# Altium project 2020年电赛校赛.PrjPcb
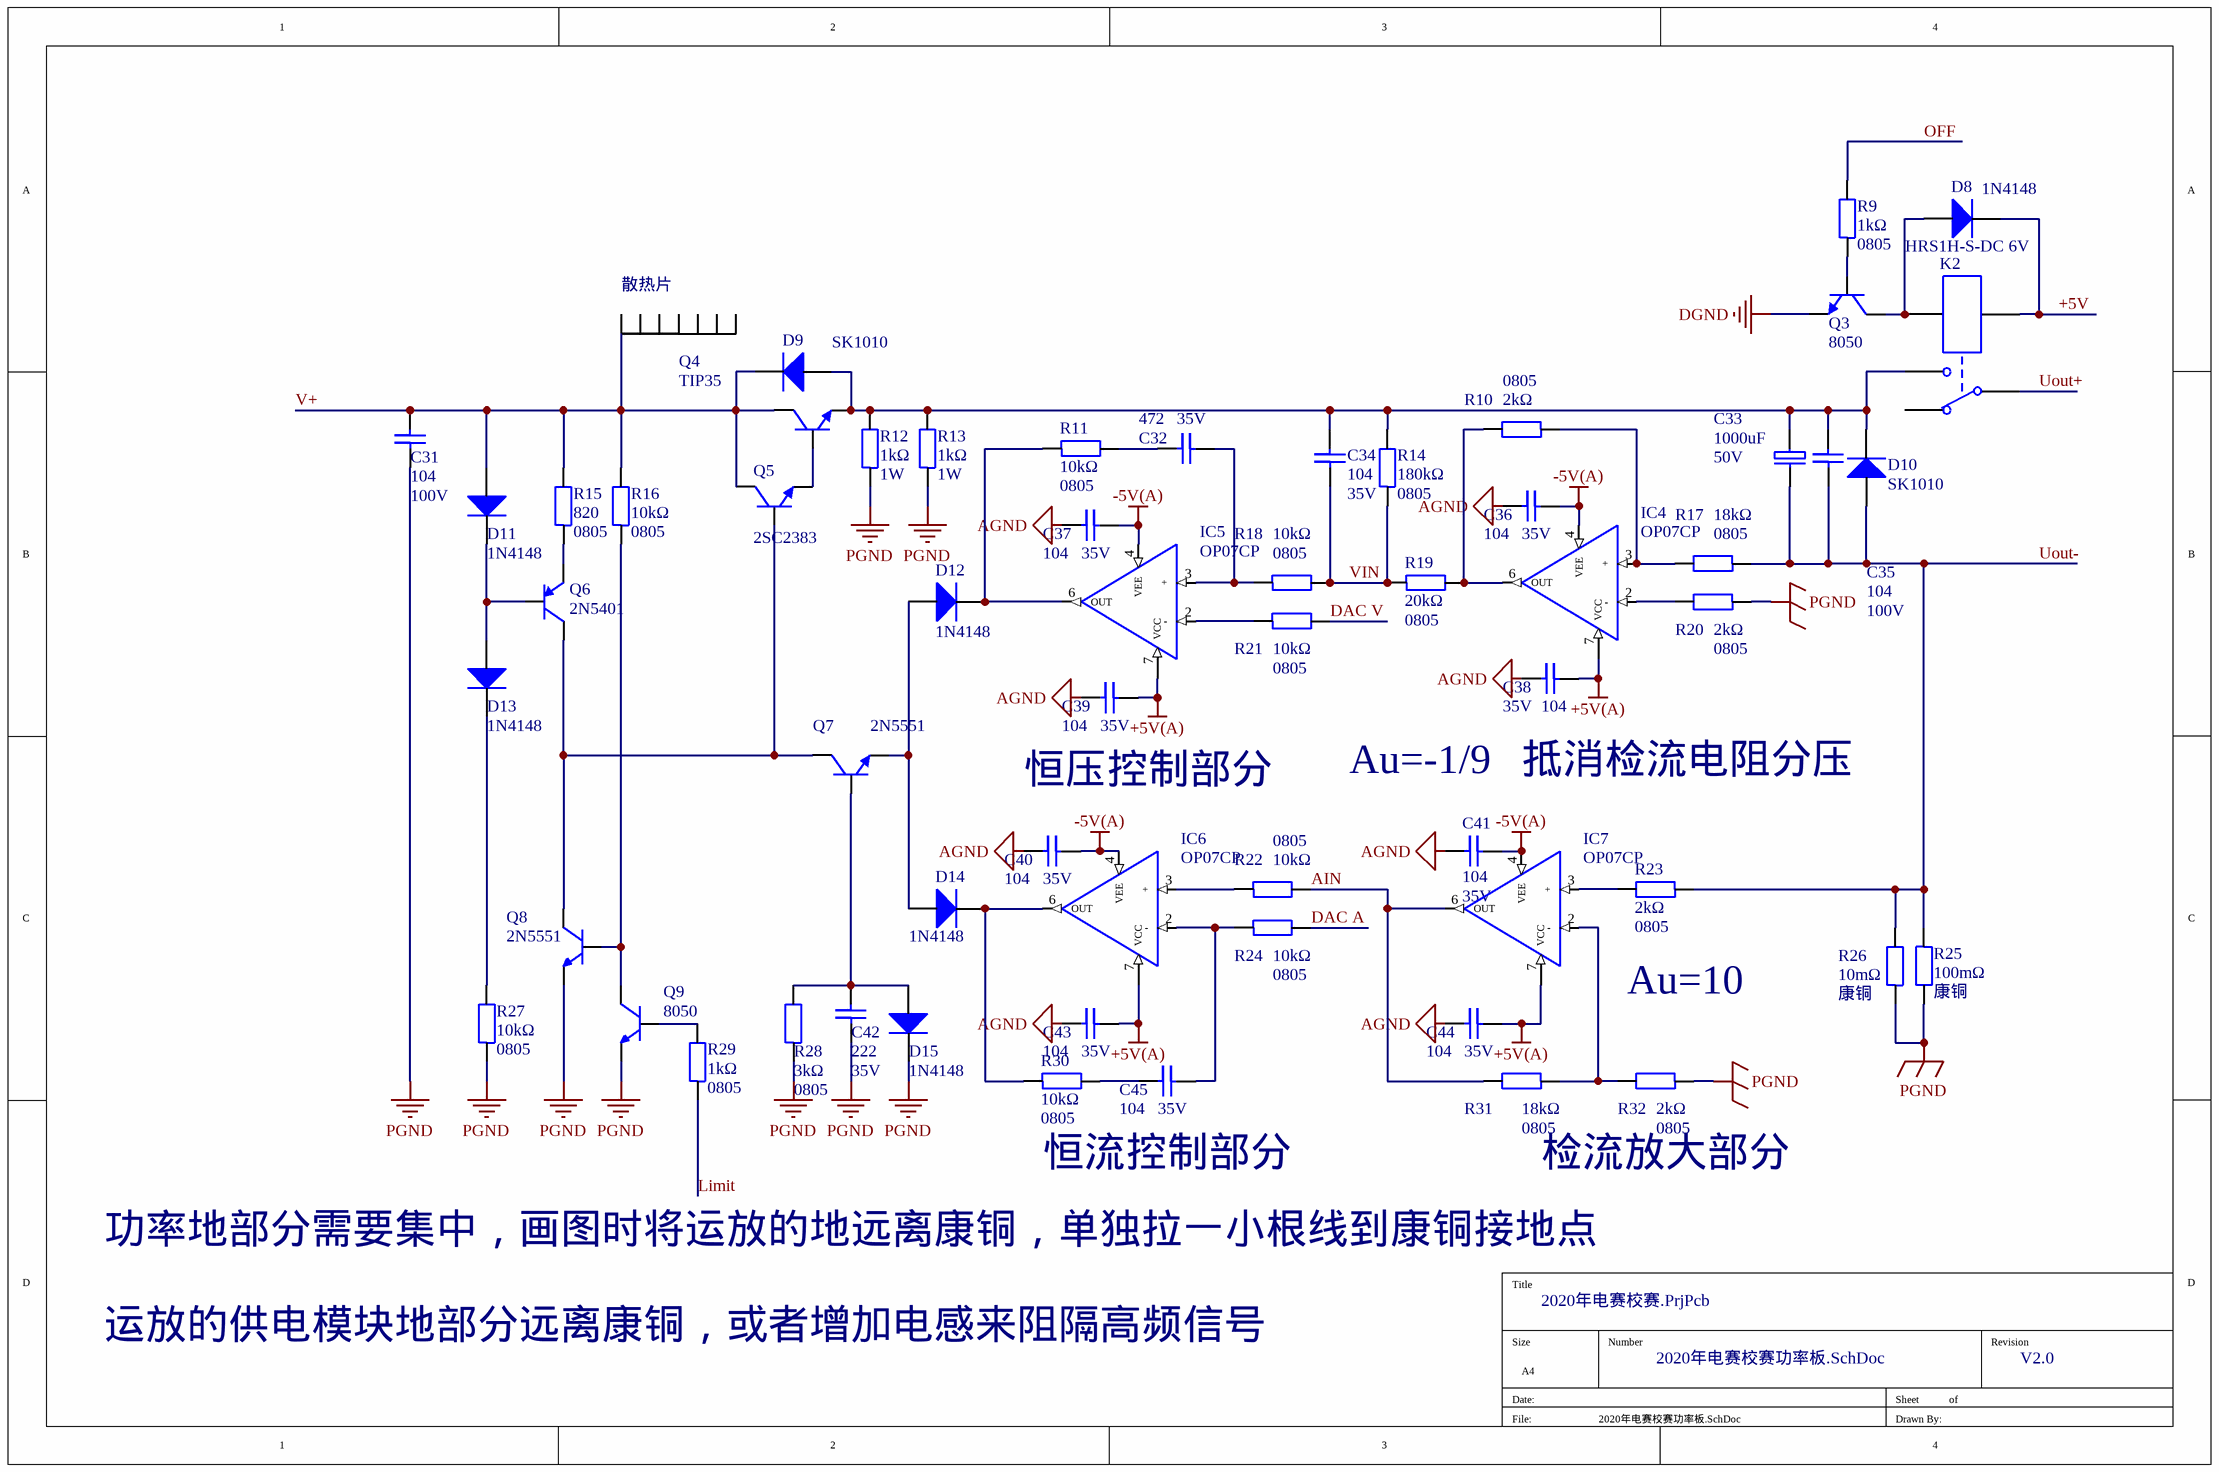
[diagram p0: 2020年电赛校赛功率板.SchDoc]
5 sheets, 183 parts. Net scope: global (net labels, ports and power ports of the same name join across sheets).
Board files: 2020年电赛校赛 V1.0.PcbDoc, 电赛校赛 V2.0.PcbDoc
Sheets:
  2020年电赛校赛功率板.SchDoc
  2020年电赛校赛电源板.SchDoc
  2020年电赛校赛测量、基准板.SchDoc
  2020年电赛校赛接口板.SchDoc
  2020年电赛校赛数字板.SchDoc

## Sheet 2020年电赛校赛功率板.SchDoc
size A4; DocumentNumber: 1; Revision: V2.0; SheetNumber: 1; SheetTotal: 5

### Parts
C31  104  value 100V  [C0805]
C32  472  value 35V  [C0805]
C33  1000uF  value 50V  [50V 1000uF]
C34  104  value 35V  [C0805]
C35  104  value 100V  [C0805]
C36  104  value 35V  [C0805]
C37  104  value 35V  [C0805]
C38  104  value 35V  [C0805]
C39  104  value 35V  [C0805]
C40  104  value 35V  [C0805]
C41  104  value 35V  [C0805]
C42  222  value 35V  [C0805]
C43  104  value 35V  [C0805]
C44  104  value 35V  [C0805]
C45  104  value 35V  [C0805]
D8  1N4148  [LL34]
D9  SK1010  [SMC(DO-214AB)]
D10  SK1010  [SMC(DO-214AB)]
D11  1N4148  [LL34]
D12  1N4148  [LL34]
D13  1N4148  [LL34]
D14  1N4148  [LL34]
D15  1N4148  [LL34]
IC4  OP07CP  [SOP-8(体宽3.8mm)]
IC5  OP07CP  [SOP-8(体宽3.8mm)]
IC6  OP07CP  [SOP-8(体宽3.8mm)]
IC7  OP07CP  [SOP-8(体宽3.8mm)]
K2  HRS1H-S-DC 6V  [HRS1H-S-DC 6V]
Q3  8050  [SOT-23]
Q4  TIP35  [TO-247]
Q5  2SC2383  [TO-92]
Q6  2N5401  [SOT-23]
Q7  2N5551  [SOT-23]
Q8  2N5551  [SOT-23]
Q9  8050  [SOT-23]
R9  1kΩ  value 0805  [R0805]
R10  2kΩ  value 0805  [R0805]
R11  10kΩ  value 0805  [R0805]
R12  1kΩ  value 1W  [Res-1W]
R13  1kΩ  value 1W  [Res-1W]
R14  180kΩ  value 0805  [R0805]
R15  820  value 0805  [R0805]
R16  10kΩ  value 0805  [R0805]
R17  18kΩ  value 0805  [R0805]
R18  10kΩ  value 0805  [R0805]
R19  20kΩ  value 0805  [R0805]
R20  2kΩ  value 0805  [R0805]
R21  10kΩ  value 0805  [R0805]
R22  10kΩ  value 0805  [R0805]
R23  2kΩ  value 0805  [R0805]
R24  10kΩ  value 0805  [R0805]
R25  100mΩ  value 康铜  [100mΩ康铜]
R26  10mΩ  value 康铜  [10mΩ康铜]
R27  10kΩ  value 0805  [R0805]
R28  3kΩ  value 0805  [R0805]
R29  1kΩ  value 0805  [R0805]
R30  10kΩ  value 0805  [R0805]
R31  18kΩ  value 0805  [R0805]
R32  2kΩ  value 0805  [R0805]
S1  散热片  [散热片]  (value not drawn)

### Nets
+5V: D8.2(K) K2.2
+5V(A): C38.2 C39.2 C43.2 C44.2 IC4.7(VCC) IC5.7(VCC) IC6.7(VCC) IC7.7(VCC)
-5V(A): C36.2 C37.2 C40.2 C41.2 IC4.4(VEE) IC5.4(VEE) IC6.4(VEE) IC7.4(VEE)
AGND: C36.1 C37.1 C38.1 C39.1 C40.1 C41.1 C43.1 C44.1
DGND: Q3.2(E)
PGND: C31.1 C42.1 D15.2(K) Q8.2(E) Q9.2(E) R12.1 R13.1 R20.1 R25.2 R26.1 R27.1 R28.1 R32.1
AIN: IC7.6(OUT) R22.2 R31.2
DAC A: R24.2
DAC V: R21.2
Limit: R29.1
OFF: R9.2
Uout+: K2.4
Uout-: C33.2(-) C35.1 D10.1(A) R17.1 R23.1 R25.1 R26.2
V+: C31.2 D9.2(K) D11.1(A) Q4.2(C) Q5.2(C) R15.2 R16.2 S1.1
VIN: C34.1 R14.1 R18.2 R19.1
NetC32_1: C32.1 R11.2
NetC32_2: C32.2 IC5.3(+) R18.1
NetC33_1: C33.1(+) C34.2 C35.2 D9.1(A) D10.2(K) K2.6 Q4.3(E) R12.2 R13.2 R14.2
NetC42_2: C42.2 D15.1(A) Q7.1(B) R28.2
NetC45_1: C45.1 R30.2
NetC45_2: C45.2 IC6.2(-) R24.1
NetD8_1: D8.1(A) K2.5 Q3.3(C)
NetD11_2: D11.2(K) D13.1(A) Q6.1(B)
NetD12_1: D12.1(A) D14.1(A) Q7.2(E)
NetD12_2: D12.2(K) IC5.6(OUT) R11.1
NetD13_2: D13.2(K) R27.2
NetD14_2: D14.2(K) IC6.6(OUT) R30.1
NetIC4_2: IC4.2(-) R20.2
NetIC4_3: IC4.3(+) R10.1 R17.2
NetIC4_6: IC4.6(OUT) R10.2 R19.2
NetIC5_2: IC5.2(-) R21.1
NetIC6_3: IC6.3(+) R22.1
NetIC7_2: IC7.2(-) R31.1 R32.2
NetIC7_3: IC7.3(+) R23.2
NetQ3_1: Q3.1(B) R9.1
NetQ4_1: Q4.1(B) Q5.1(E)
NetQ5_3: Q5.3(B) Q6.3(C) Q7.3(C) Q8.3(C)
NetQ6_2: Q6.2(E) R15.1
NetQ8_1: Q8.1(B) Q9.3(C) R16.1
NetQ9_1: Q9.1(B) R29.2

Not connected (* = marked no-connect by the designer): K2 1; S1 2

### Notes on the sheet
- (near S1) 散热片
- 恒压控制部分
- Au=-1/9
- 抵消检流电阻分压
- Au=10
- 恒流控制部分
- 检流放大部分
- 功率地部分需要集中，画图时将运放的地远离康铜，单独拉一小根线到康铜接地点
- 运放的供电模块地部分远离康铜，或者增加电感来阻隔高频信号

### Library data of the parts
C31 C32 C34-C45 = 104: 无极性电容
C33 = 100uF: 有极性电容
D8-D15 = Diode: 二极管
IC4-IC7 = OP07CP: 运放
K2 = HRS1H-S-DC 6V: 继电器
Q3-Q5 Q7 = NPN: 三极管
Q6 = PNP
Q8 = NPN!
Q9 = NPN!: 三极管
R9-R32 = 10kΩ: 贴片/直插电阻

## Sheet 2020年电赛校赛电源板.SchDoc
size A4; DocumentNumber: 2; Revision: V2.0; SheetNumber: 2; SheetTotal: 5
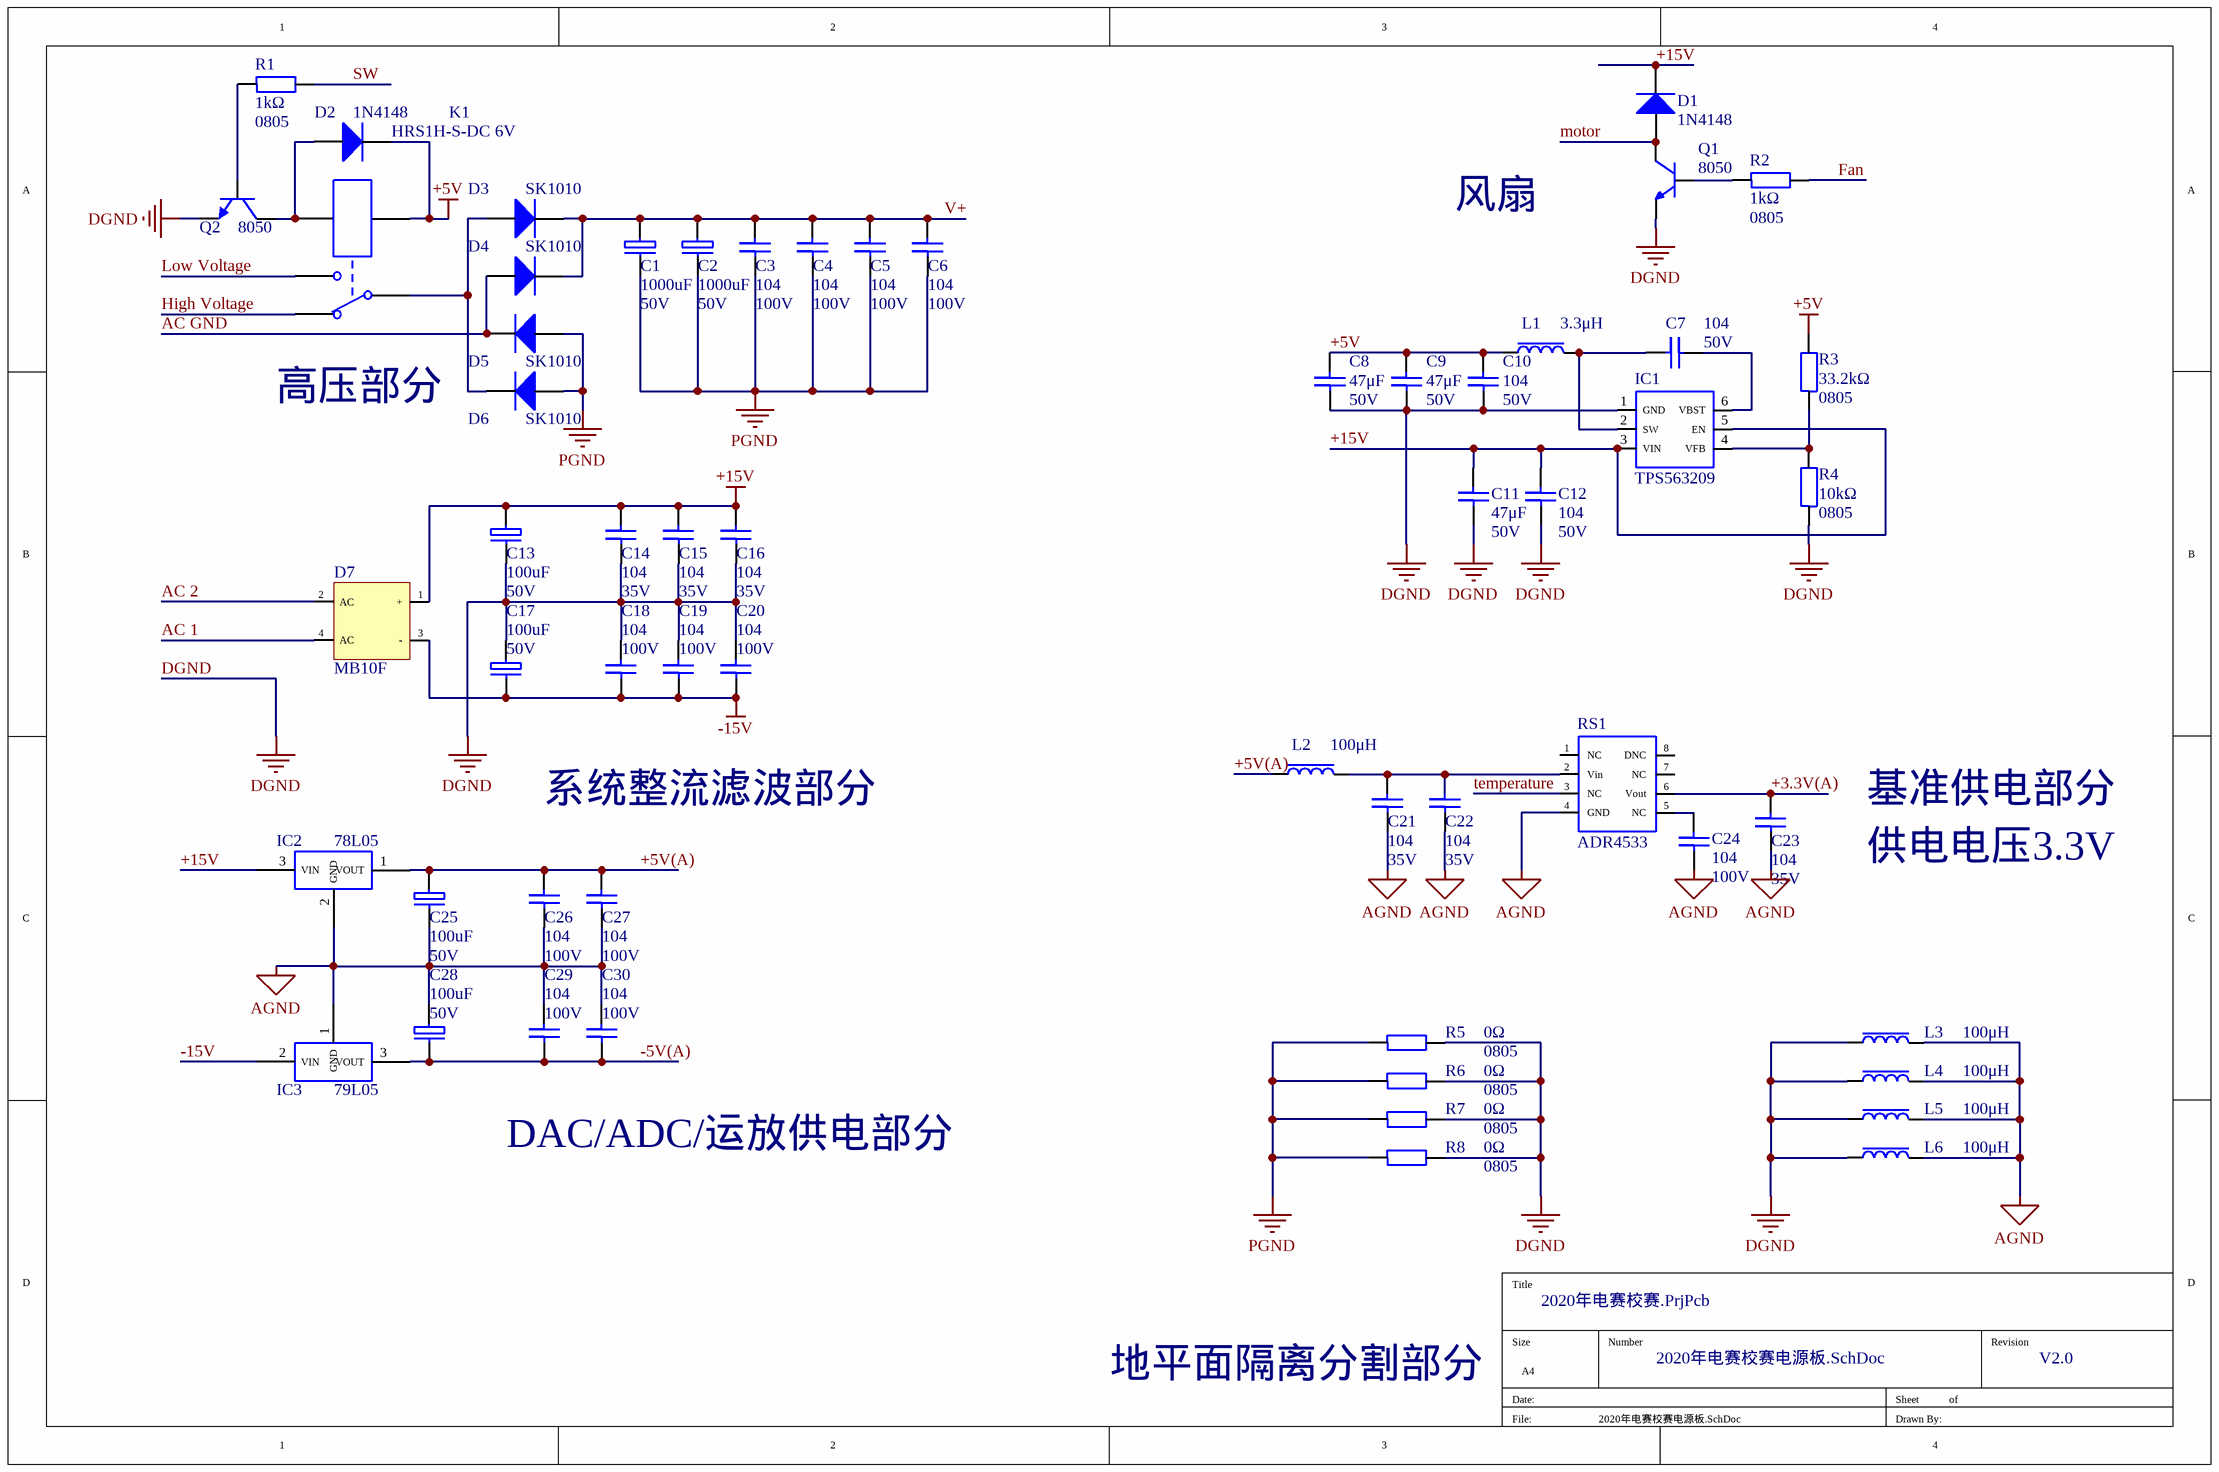
[diagram p1: 2020年电赛校赛电源板.SchDoc]

### Parts
C1  1000uF  value 50V  [50V 1000uF]
C2  1000uF  value 50V  [50V 1000uF]
C3  104  value 100V  [C0805]
C4  104  value 100V  [C0805]
C5  104  value 100V  [C0805]
C6  104  value 100V  [C0805]
C7  104  value 50V  [C0805]
C8  47μF  value 50V  [C1210]
C9  47μF  value 50V  [C1210]
C10  104  value 50V  [C0805]
C11  47μF  value 50V  [C1210]
C12  104  value 50V  [C0805]
C13  100uF  value 50V  [35V 470uF]
C14  104  value 35V  [C0805]
C15  104  value 35V  [C0805]
C16  104  value 35V  [C0805]
C17  100uF  value 50V  [35V 470uF]
C18  104  value 100V  [C0805]
C19  104  value 100V  [C0805]
C20  104  value 100V  [C0805]
C21  104  value 35V  [C0805]
C22  104  value 35V  [C0805]
C23  104  value 35V  [C0805]
C24  104  value 100V  [C0805]
C25  100uF  value 50V  [35V 470uF]
C26  104  value 100V  [C0805]
C27  104  value 100V  [C0805]
C28  100uF  value 50V  [35V 470uF]
C29  104  value 100V  [C0805]
C30  104  value 100V  [C0805]
D1  1N4148  [LL34]
D2  1N4148  [LL34]
D3  SK1010  [SMC(DO-214AB)]
D4  SK1010  [SMC(DO-214AB)]
D5  SK1010  [SMC(DO-214AB)]
D6  SK1010  [SMC(DO-214AB)]
D7  MB10F  [整流桥 SMD]
IC1  TPS563209  [TSOP-6]
IC2  78L05  [SOT-89]
IC3  79L05  [SOT-89]
K1  HRS1H-S-DC 6V  [HRS1H-S-DC 6V]
L1  3.3μH  [L0630]
L2  100μH  [R0805]
L3  100μH  [R0805]
L4  100μH  [R0805]
L5  100μH  [R0805]
L6  100μH  [R0805]
Q1  8050  [SOT-23]
Q2  8050  [SOT-23]
R1  1kΩ  value 0805  [R0805]
R2  1kΩ  value 0805  [R0805]
R3  33.2kΩ  value 0805  [R0805]
R4  10kΩ  value 0805  [R0805]
R5  0Ω  value 0805  [R0805]
R6  0Ω  value 0805  [R0805]
R7  0Ω  value 0805  [R0805]
R8  0Ω  value 0805  [R0805]
RS1  ADR4533  [SOP-8(体宽3.8mm)]

### Nets
+5V: C8.2 C9.2 C10.2 D2.2(K) K1.2 L1.2 R3.2
+5V(A): C25.1(+) C26.2 C27.2 IC2.1(VOUT) L2.2
+15V: C11.2 C12.2 C13.1(+) C14.2 C15.2 C16.2 D1.2(K) D7.1(+) IC1.3(VIN) IC1.5(EN) IC2.3(VIN)
-5V(A): C28.2(-) C29.1 C30.1 IC3.3(VOUT)
-15V: C17.2(-) C18.1 C19.1 C20.1 D7.3(-) IC3.2(VIN)
AGND: C21.1 C22.1 C23.1 C24.1 C25.2(-) C26.1 C27.1 C28.1(+) C29.2 C30.2 IC2.2(GND) IC3.1(GND) L3.1 L4.1 L5.1 L6.1 RS1.4(GND)
DGND: C8.1 C9.1 C10.1 C11.1 C12.1 C13.2(-) C14.1 C15.1 C16.1 C17.1(+) C18.2 C19.2 C20.2 IC1.1(GND) L3.2 L4.2 L5.2 L6.2 Q1.2(E) Q2.2(E) R4.1 R5.2 R6.2 R7.2 R8.2
PGND: C1.2(-) C2.2(-) C3.1 C4.1 C5.1 C6.1 D5.1(A) D6.1(A) R5.1 R6.1 R7.1 R8.1
+3.3V(A): C23.2 RS1.6(Vout)
AC 1: D7.4(AC)
AC 2: D7.2(AC)
AC GND: D4.1(A) D5.2(K)
Fan: R2.2
High Voltage: K1.1
Low Voltage: K1.6
motor: D1.1(A) Q1.3(C)
SW: R1.2
temperature: RS1.3(NC)
V+: C1.1(+) C2.1(+) C3.2 C4.2 C5.2 C6.2 D3.2(K) D4.2(K)
NetC7_1: C7.1 IC1.2(SW) L1.1
NetC7_2: C7.2 IC1.6(VBST)
NetC21_2: C21.2 C22.2 L2.1 RS1.2(Vin)
NetC24_2: C24.2 RS1.5(NC)
NetD2_1: D2.1(A) K1.5 Q2.3(C)
NetD3_1: D3.1(A) D6.2(K) K1.4
NetIC1_4: IC1.4(VFB) R3.1 R4.2
NetQ1_1: Q1.1(B) R2.1
NetQ2_1: Q2.1(B) R1.1

Not connected (* = marked no-connect by the designer): RS1 1(NC) 7(NC) 8(DNC)

### Notes on the sheet
- 风扇
- (near K1) 高压部分
- 系统整流滤波部分
- 基准供电部分
- 供电电压3.3V
- DAC/ADC/运放供电部分
- 地平面隔离分割部分

### Library data of the parts
C1 C2 C13 C17 C25 C28 = 100uF: 有极性电容
C3-C12 C14-C16 C18-C24 C26 C27 C29 C30 = 104: 无极性电容
D1-D6 = Diode: 二极管
D7 = MB10F: 1A 1000V整流桥
IC1 = TPS563209/563309: buck型电源管理
IC2 = AMS1117-3.3: LDO
IC3 = 790?: LDO
K1 = HRS1H-S-DC 6V: 继电器
L1-L6 = 470mH: 电感
Q1 = NPN!: 三极管
Q2 = NPN: 三极管
R1-R8 = 10kΩ: 贴片/直插电阻
RS1 = ADR4533: 高精度基准源

## Sheet 2020年电赛校赛测量、基准板.SchDoc
size A4; DocumentNumber: 3; Revision: V2.0; SheetNumber: 3; SheetTotal: 5
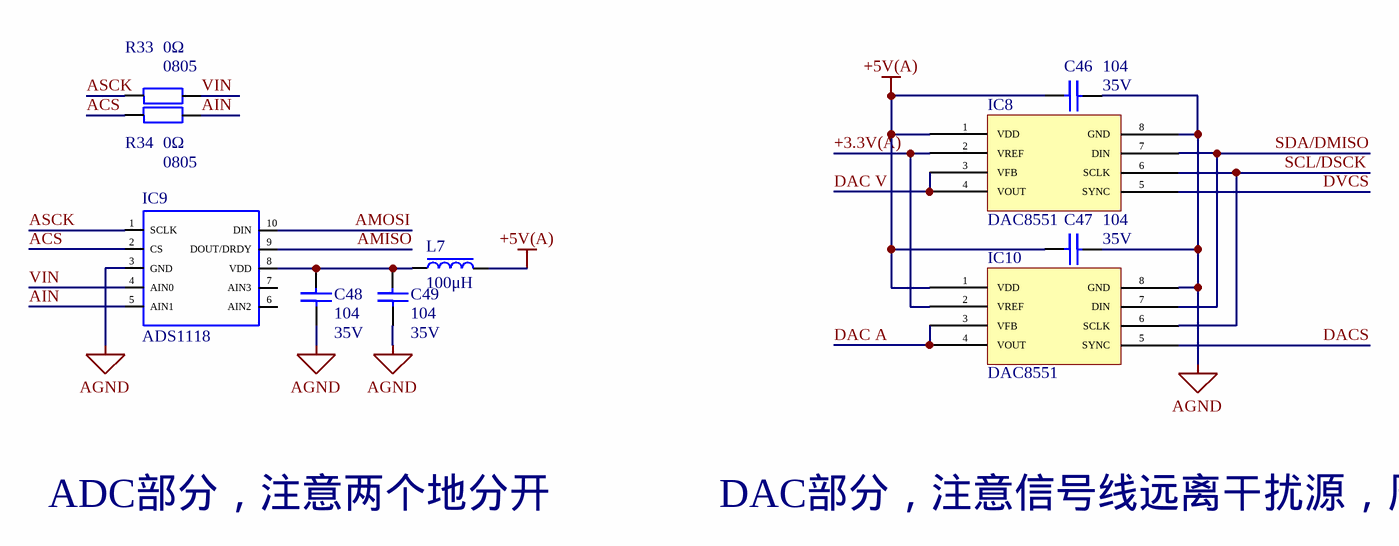
[diagram p2: 2020年电赛校赛测量、基准板.SchDoc]

### Parts
C46  104  value 35V  [C0805]
C47  104  value 35V  [C0805]
C48  104  value 35V  [C0805]
C49  104  value 35V  [C0805]
IC8  DAC8551  [MSOP-8]
IC9  ADS1118  [MSOP-10]
IC10  DAC8551  [MSOP-8]
L7  100μH  [R0805]
R33  0Ω  value 0805  [R0805]
R34  0Ω  value 0805  [R0805]

### Nets
+5V(A): C46.1 C47.1 IC8.1(VDD) IC10.1(VDD) L7.1
AGND: C46.2 C47.2 C48.1 C49.1 IC8.8(GND) IC9.3(GND) IC10.8(GND)
+3.3V(A): IC8.2(VREF) IC10.2(VREF)
ACS: IC9.2(CS) R34.1
AIN: IC9.5(AIN1) R34.2
AMISO: IC9.9(DOUT/DRDY)
AMOSI: IC9.10(DIN)
ASCK: IC9.1(SCLK) R33.1
DAC A: IC10.3(VFB) IC10.4(VOUT)
DAC V: IC8.3(VFB) IC8.4(VOUT)
DACS: IC10.5(SYNC)
DVCS: IC8.5(SYNC)
SCL/DSCK: IC8.6(SCLK) IC10.6(SCLK)
SDA/DMISO: IC8.7(DIN) IC10.7(DIN)
VIN: IC9.4(AIN0) R33.2
NetC48_2: C48.2 C49.2 IC9.8(VDD) L7.2

Not connected (* = marked no-connect by the designer): IC9 6(AIN2) 7(AIN3)

### Notes on the sheet
- ADC部分，注意两个地分开
- DAC部分，注意信号线远离干扰源，周围围模拟地

### Library data of the parts
C46-C49 = 104: 无极性电容
IC9 = ADS1118: 16bit ADC 860SPS 4路单端/两路差分
L7 = 470mH: 电感
R33 R34 = 10kΩ: 贴片/直插电阻

## Sheet 2020年电赛校赛接口板.SchDoc
size A4; DocumentNumber: 4; Revision: V2.0; SheetNumber: 4; SheetTotal: 5
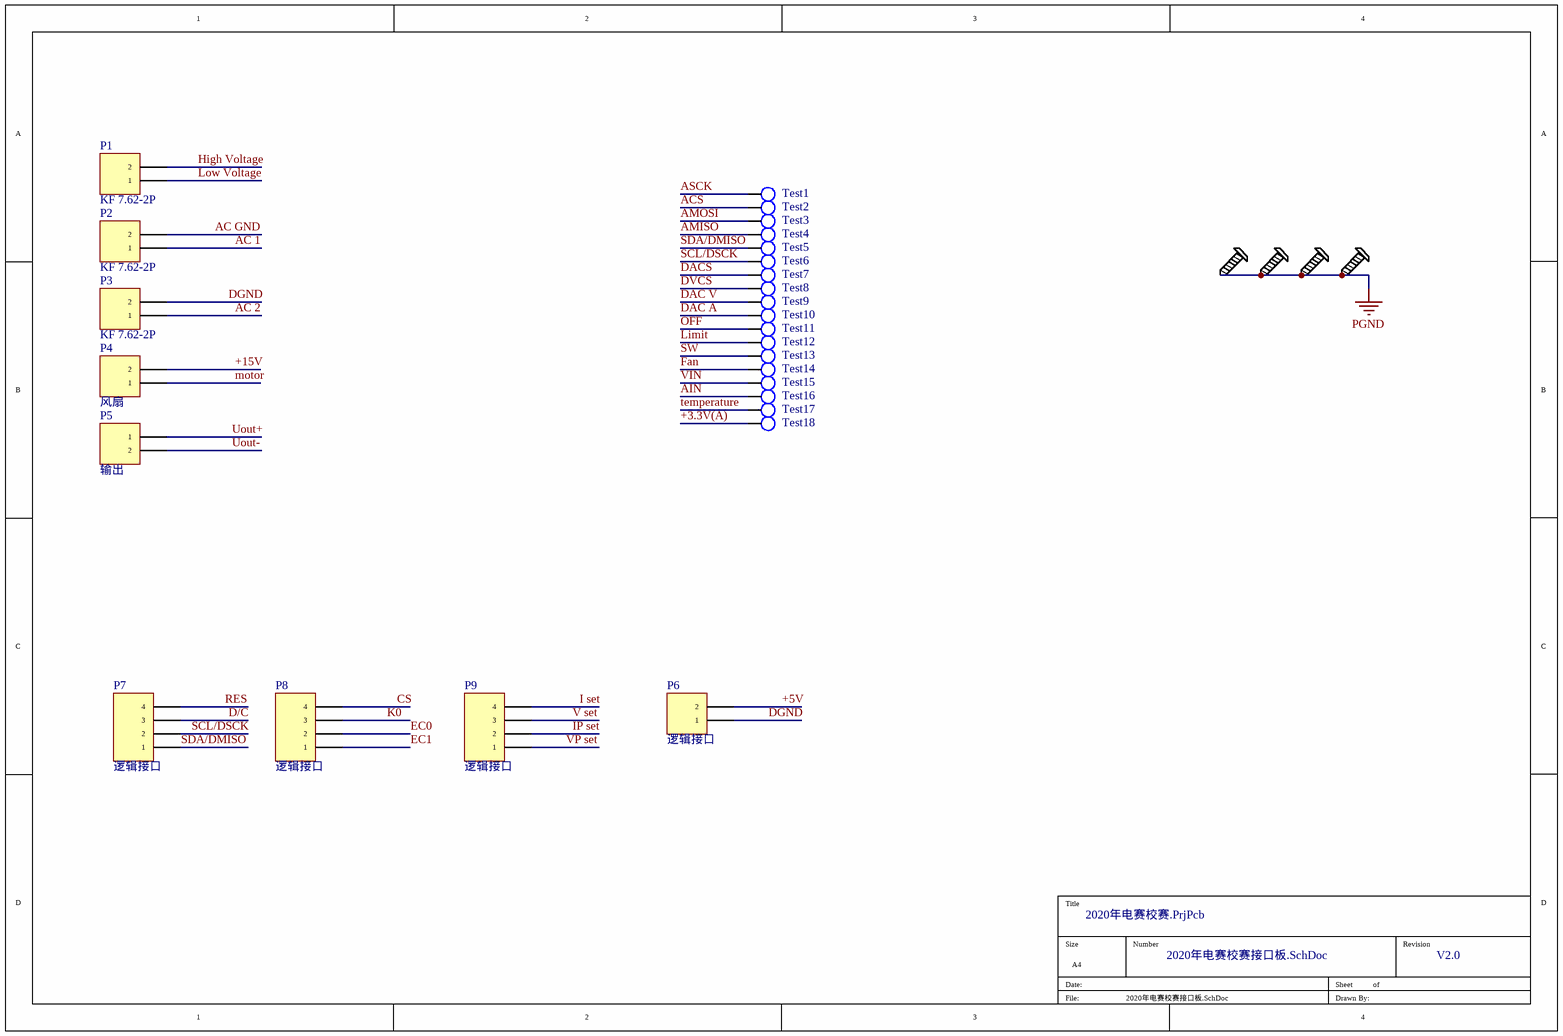
[diagram p3: 2020年电赛校赛接口板.SchDoc]

### Parts
P1  KF 7.62-2P  [KF7.62-2P]
P2  KF 7.62-2P  [KF7.62-2P]
P3  KF 7.62-2P  [KF7.62-2P]
P4  风扇  [XH2.54-2P]
P5  输出  [KF7.62-2P]
P6  逻辑接口  [XH2.54-2P]
P7  逻辑接口  [XH2.54-4P]
P8  逻辑接口  [XH2.54-4P]
P9  逻辑接口  [XH2.54-4P]
S2  M3铜柱  [M3x4+6_L]  (value not drawn)
S3  M3铜柱  [M3x4+6_L]  (value not drawn)
S4  M3铜柱  [M3x4+6_L]  (value not drawn)
S5  M3铜柱  [M3x4+6_L]  (value not drawn)
Test1  测试点  [point]  (value not drawn)
Test2  测试点  [point]  (value not drawn)
Test3  测试点  [point]  (value not drawn)
Test4  测试点  [point]  (value not drawn)
Test5  测试点  [point]  (value not drawn)
Test6  测试点  [point]  (value not drawn)
Test7  测试点  [point]  (value not drawn)
Test8  测试点  [point]  (value not drawn)
Test9  测试点  [point]  (value not drawn)
Test10  测试点  [point]  (value not drawn)
Test11  测试点  [point]  (value not drawn)
Test12  测试点  [point]  (value not drawn)
Test13  测试点  [point]  (value not drawn)
Test14  测试点  [point]  (value not drawn)
Test15  测试点  [point]  (value not drawn)
Test16  测试点  [point]  (value not drawn)
Test17  测试点  [point]  (value not drawn)
Test18  测试点  [point]  (value not drawn)

### Nets
+5V: P6.2
+15V: P4.2
DGND: P3.2 P6.1
PGND: S2.1(GND) S3.1(GND) S4.1(GND) S5.1(GND)
+3.3V(A): Test18.1(测试点)
AC 1: P2.1
AC 2: P3.1
AC GND: P2.2
ACS: Test2.1(测试点)
AIN: Test16.1(测试点)
AMISO: Test4.1(测试点)
AMOSI: Test3.1(测试点)
ASCK: Test1.1(测试点)
CS: P8.4
D/C: P7.3
DAC A: Test10.1(测试点)
DAC V: Test9.1(测试点)
DACS: Test7.1(测试点)
DVCS: Test8.1(测试点)
EC0: P8.2
EC1: P8.1
Fan: Test14.1(测试点)
High Voltage: P1.2
I set: P9.4
IP set: P9.2
K0: P8.3
Limit: Test12.1(测试点)
Low Voltage: P1.1
motor: P4.1
OFF: Test11.1(测试点)
RES: P7.4
SCL/DSCK: P7.2 Test6.1(测试点)
SDA/DMISO: P7.1 Test5.1(测试点)
SW: Test13.1(测试点)
temperature: Test17.1(测试点)
Uout+: P5.1
Uout-: P5.2
V set: P9.3
VIN: Test15.1(测试点)
VP set: P9.1

### Library data of the parts
P1-P6 = Header 2: Header, 2-Pin; LatestRevisionDate: 17-Jul-2002; LatestRevisionNote: Re-released for DXP Platform.; Publisher: Altium Limited
P7-P9 = Header 4: Header, 4-Pin; LatestRevisionDate: 17-Jul-2002; LatestRevisionNote: Re-released for DXP Platform.; Publisher: Altium Limited

## Sheet 2020年电赛校赛数字板.SchDoc
size A4; DocumentNumber: 5; Revision: V1.0; SheetNumber: 5; SheetTotal: 5
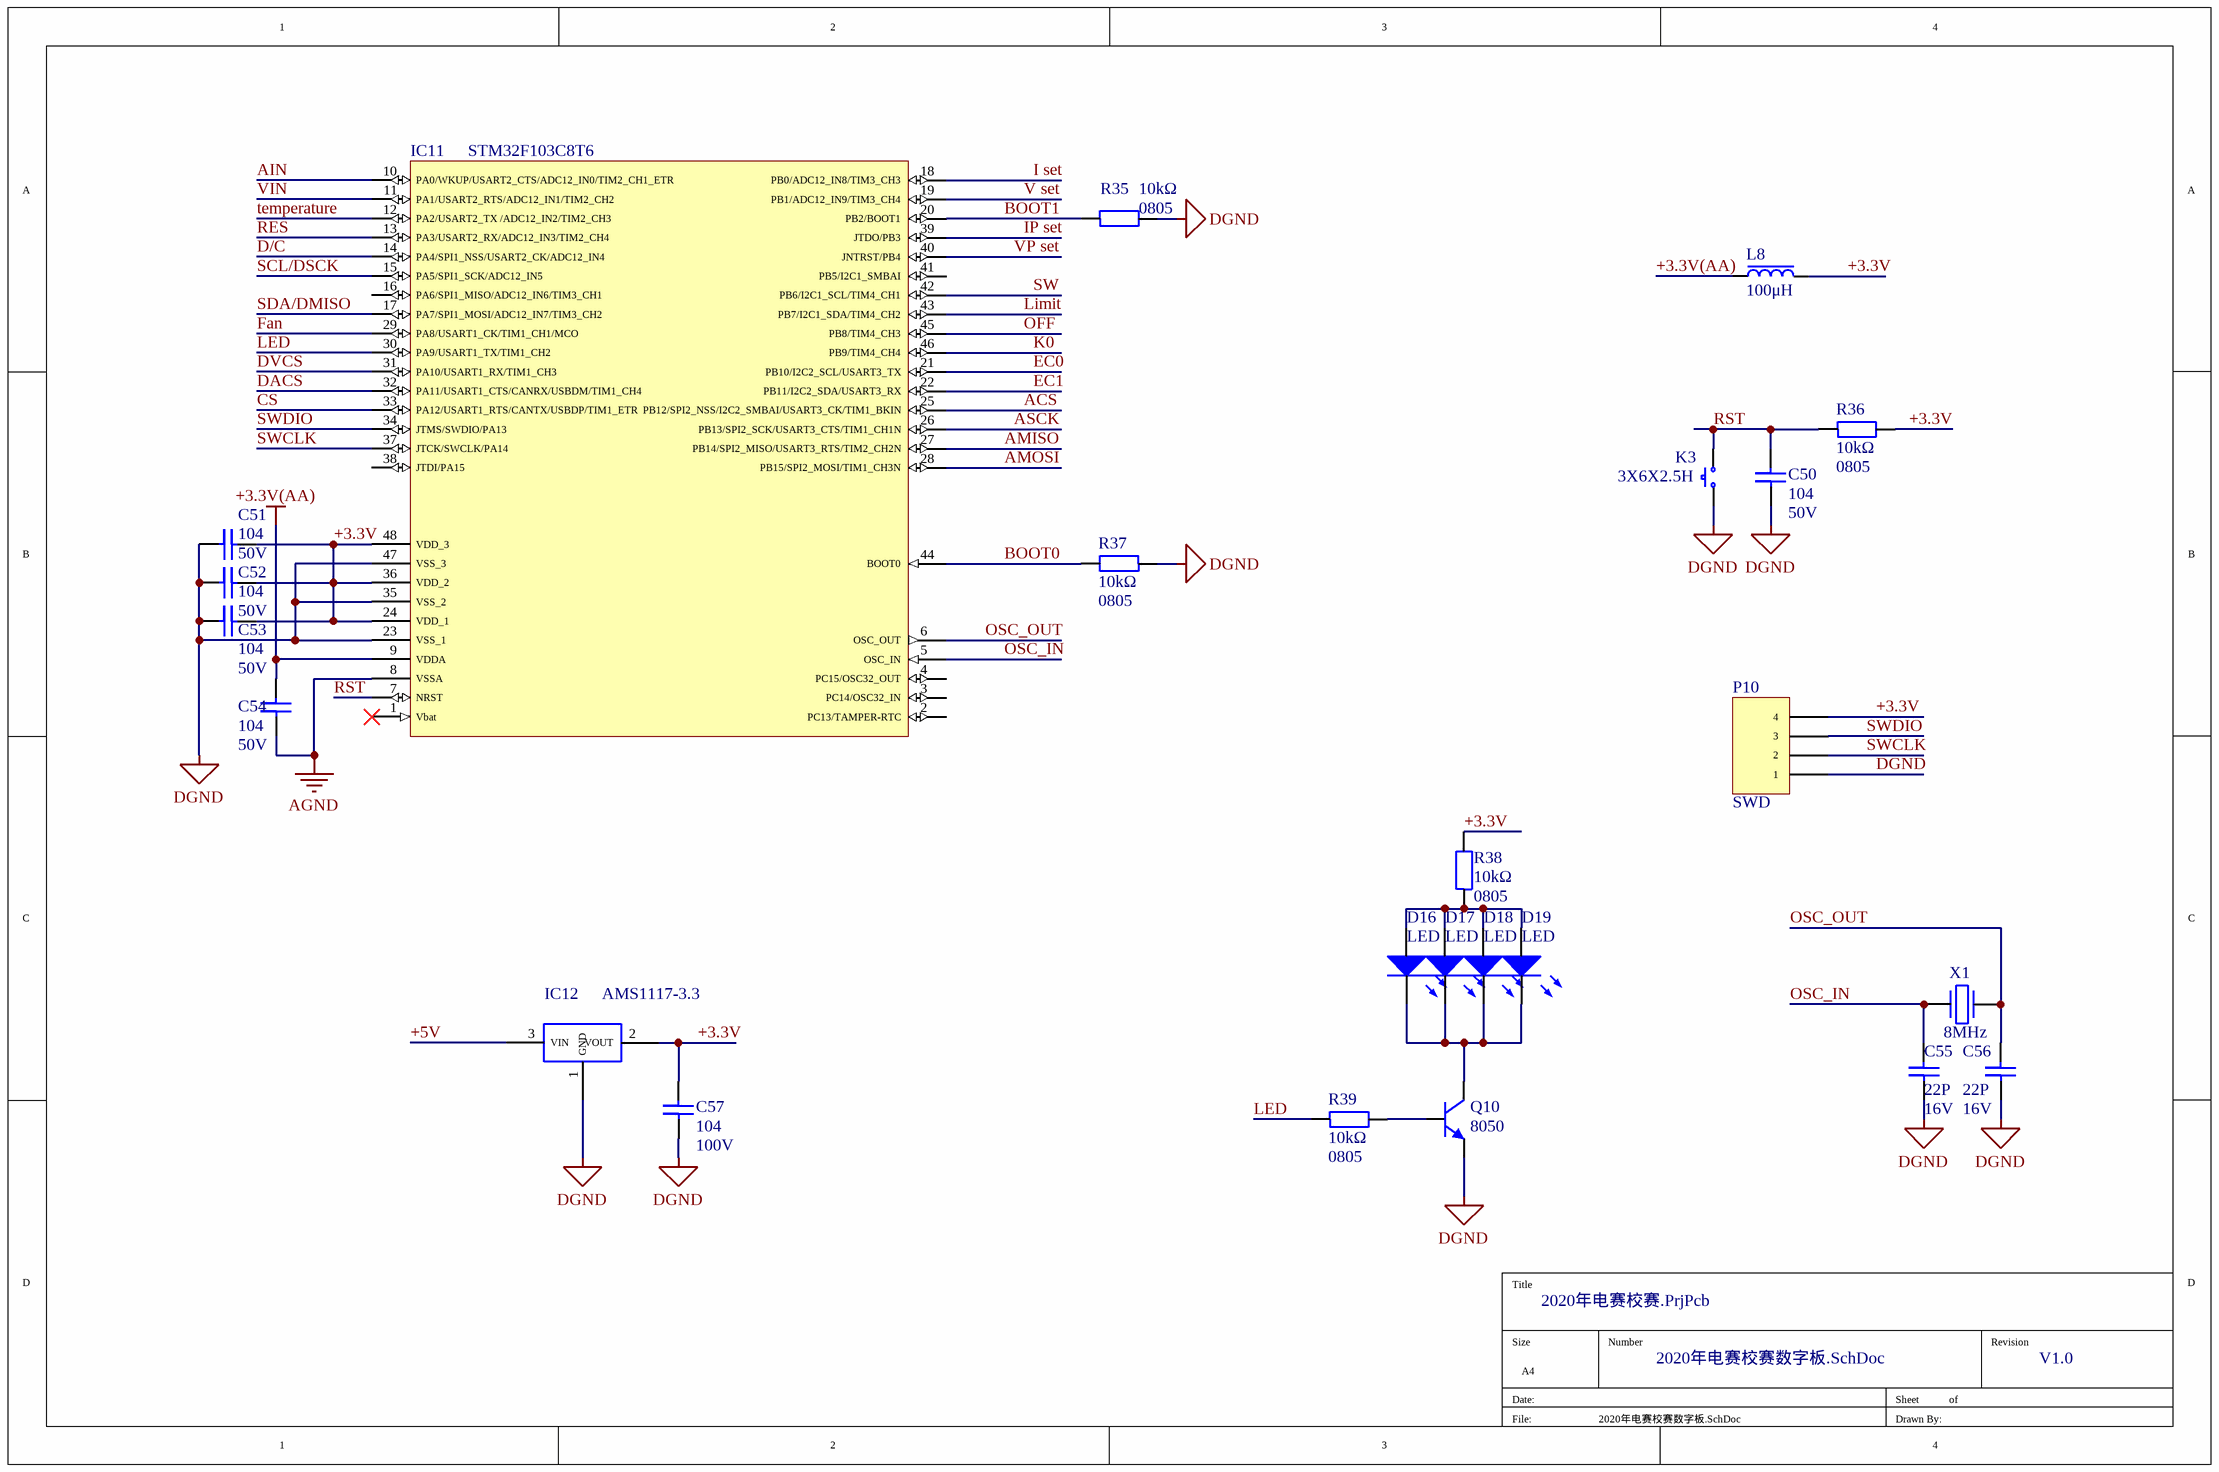
[diagram p4: 2020年电赛校赛数字板.SchDoc]

### Parts
C50  104  value 50V  [C0805]
C51  104  value 50V  [C0805]
C52  104  value 50V  [C0805]
C53  104  value 50V  [C0805]
C54  104  value 50V  [C0805]
C55  22P  value 16V  [C0805]
C56  22P  value 16V  [C0805]
C57  104  value 100V  [C0805]
D16  LED  [LED0805(反贴)]
D17  LED  [LED0805(反贴)]
D18  LED  [LED0805(反贴)]
D19  LED  [LED0805(反贴)]
IC11  STM32F103C8T6  [LQFP-48(0.5MM) - duplicate]
IC12  AMS1117-3.3  [SOT-89]
K3  3X6X2.5H  [3X6X2.5H]
L8  100μH  [R0805]
P10  SWD  [HDR2.54-LI-4P]
Q10  8050  [SOT-23]
R35  10kΩ  value 0805  [R0805]
R36  10kΩ  value 0805  [R0805]
R37  10kΩ  value 0805  [R0805]
R38  10kΩ  value 0805  [R0805]
R39  10kΩ  value 0805  [R0805]
X1  8MHz  [Crystal 3225-4P]

### Nets
+3.3V(AA): C54.2 IC11.9(VDDA) L8.2
+5V: IC12.3(VIN)
AGND: C54.1 IC11.8(VSSA)
DGND: C50.1 C51.1 C52.1 C53.1 C55.1 C56.1 C57.1 IC11.23(VSS_1) IC11.35(VSS_2) IC11.47(VSS_3) IC12.1(GND) K3.1 P10.1 Q10.2(E) R35.2 R37.1
+3.3V: C51.2 C52.2 C53.2 C57.2 IC11.24(VDD_1) IC11.36(VDD_2) IC11.48(VDD_3) IC12.2(VOUT) L8.1 P10.4 R36.2 R38.2
ACS: IC11.25(PB12/SPI2_NSS/I2C2_SMBAI/USART3_CK/TIM1_BKIN)
AIN: IC11.10(PA0/WKUP/USART2_CTS/ADC12_IN0/TIM2_CH1_ETR)
AMISO: IC11.27(PB14/SPI2_MISO/USART3_RTS/TIM2_CH2N)
AMOSI: IC11.28(PB15/SPI2_MOSI/TIM1_CH3N)
ASCK: IC11.26(PB13/SPI2_SCK/USART3_CTS/TIM1_CH1N)
BOOT0: IC11.44(BOOT0) R37.2
BOOT1: IC11.20(PB2/BOOT1) R35.1
CS: IC11.33(PA12/USART1_RTS/CANTX/USBDP/TIM1_ETR)
D/C: IC11.14(PA4/SPI1_NSS/USART2_CK/ADC12_IN4)
DACS: IC11.32(PA11/USART1_CTS/CANRX/USBDM/TIM1_CH4)
DVCS: IC11.31(PA10/USART1_RX/TIM1_CH3)
EC0: IC11.21(PB10/I2C2_SCL/USART3_TX)
EC1: IC11.22(PB11/I2C2_SDA/USART3_RX)
Fan: IC11.29(PA8/USART1_CK/TIM1_CH1/MCO)
I set: IC11.18(PB0/ADC12_IN8/TIM3_CH3)
IP set: IC11.39(JTDO/PB3)
K0: IC11.46(PB9/TIM4_CH4)
LED: IC11.30(PA9/USART1_TX/TIM1_CH2) R39.1
Limit: IC11.43(PB7/I2C1_SDA/TIM4_CH2)
OFF: IC11.45(PB8/TIM4_CH3)
OSC_IN: C55.2 IC11.5(OSC_IN) X1.2
OSC_OUT: C56.2 IC11.6(OSC_OUT) X1.1
RES: IC11.13(PA3/USART2_RX/ADC12_IN3/TIM2_CH4)
RST: C50.2 IC11.7(NRST) K3.2 R36.1
SCL/DSCK: IC11.15(PA5/SPI1_SCK/ADC12_IN5)
SDA/DMISO: IC11.17(PA7/SPI1_MOSI/ADC12_IN7/TIM3_CH2)
SW: IC11.42(PB6/I2C1_SCL/TIM4_CH1)
SWCLK: IC11.37(JTCK/SWCLK/PA14) P10.2
SWDIO: IC11.34(JTMS/SWDIO/PA13) P10.3
temperature: IC11.12(PA2/USART2_TX_/ADC12_IN2/TIM2_CH3)
V set: IC11.19(PB1/ADC12_IN9/TIM3_CH4)
VIN: IC11.11(PA1/USART2_RTS/ADC12_IN1/TIM2_CH2)
VP set: IC11.40(JNTRST/PB4)
NetD16_1: D16.1(A) D17.1(A) D18.1(A) D19.1(A) R38.1
NetD16_2: D16.2(K) D17.2(K) D18.2(K) D19.2(K) Q10.3(C)
NetQ10_1: Q10.1(B) R39.2

Not connected (* = marked no-connect by the designer): IC11 1(Vbat)* 2(PC13/TAMPER-RTC) 3(PC14/OSC32_IN) 4(PC15/OSC32_OUT) 16(PA6/SPI1_MISO/ADC12_IN6/TIM3_CH1) 38(JTDI/PA15) 41(PB5/I2C1_SMBAI)

### Library data of the parts
C50-C57 = 104: 无极性电容
IC11 = STM32F103C8T6: STM32单片机
IC12 = AMS1117-3.3: LDO
K3 = 3X6X2.5H: 贴片按键
L8 = 470mH: 电感
P10 = Header 4: Header, 4-Pin; LatestRevisionDate: 17-Jul-2002; LatestRevisionNote: Re-released for DXP Platform.; Publisher: Altium Limited
Q10 = NPN: 三极管
R35-R39 = 10kΩ: 贴片/直插电阻
X1 = 8MHz: 无源晶振

## Nets that join several sheets
+5V: 2020年电赛校赛功率板 (D8.2 K2.2), 2020年电赛校赛电源板 (7 pins), 2020年电赛校赛接口板 (P6.2), 2020年电赛校赛数字板 (IC12.3)
+5V(A): 2020年电赛校赛功率板 (8 pins), 2020年电赛校赛电源板 (5 pins), 2020年电赛校赛测量、基准板 (5 pins)
+15V: 2020年电赛校赛电源板 (11 pins), 2020年电赛校赛接口板 (P4.2)
-5V(A): 2020年电赛校赛功率板 (8 pins), 2020年电赛校赛电源板 (C28.2 C29.1 C30.1 IC3.3)
AGND: 2020年电赛校赛功率板 (8 pins), 2020年电赛校赛电源板 (17 pins), 2020年电赛校赛测量、基准板 (7 pins), 2020年电赛校赛数字板 (C54.1 IC11.8)
DGND: 2020年电赛校赛功率板 (Q3.2), 2020年电赛校赛电源板 (25 pins), 2020年电赛校赛接口板 (P3.2 P6.1), 2020年电赛校赛数字板 (16 pins)
PGND: 2020年电赛校赛功率板 (13 pins), 2020年电赛校赛电源板 (12 pins), 2020年电赛校赛接口板 (S2.1 S3.1 S4.1 S5.1)
+3.3V(A): 2020年电赛校赛电源板 (C23.2 RS1.6), 2020年电赛校赛测量、基准板 (IC8.2 IC10.2), 2020年电赛校赛接口板 (Test18.1)
AC 1: 2020年电赛校赛电源板 (D7.4), 2020年电赛校赛接口板 (P2.1)
AC 2: 2020年电赛校赛电源板 (D7.2), 2020年电赛校赛接口板 (P3.1)
AC GND: 2020年电赛校赛电源板 (D4.1 D5.2), 2020年电赛校赛接口板 (P2.2)
ACS: 2020年电赛校赛测量、基准板 (IC9.2 R34.1), 2020年电赛校赛接口板 (Test2.1), 2020年电赛校赛数字板 (IC11.25)
AIN: 2020年电赛校赛功率板 (IC7.6 R22.2 R31.2), 2020年电赛校赛测量、基准板 (IC9.5 R34.2), 2020年电赛校赛接口板 (Test16.1), 2020年电赛校赛数字板 (IC11.10)
AMISO: 2020年电赛校赛测量、基准板 (IC9.9), 2020年电赛校赛接口板 (Test4.1), 2020年电赛校赛数字板 (IC11.27)
AMOSI: 2020年电赛校赛测量、基准板 (IC9.10), 2020年电赛校赛接口板 (Test3.1), 2020年电赛校赛数字板 (IC11.28)
ASCK: 2020年电赛校赛测量、基准板 (IC9.1 R33.1), 2020年电赛校赛接口板 (Test1.1), 2020年电赛校赛数字板 (IC11.26)
CS: 2020年电赛校赛接口板 (P8.4), 2020年电赛校赛数字板 (IC11.33)
D/C: 2020年电赛校赛接口板 (P7.3), 2020年电赛校赛数字板 (IC11.14)
DAC A: 2020年电赛校赛功率板 (R24.2), 2020年电赛校赛测量、基准板 (IC10.3 IC10.4), 2020年电赛校赛接口板 (Test10.1)
DAC V: 2020年电赛校赛功率板 (R21.2), 2020年电赛校赛测量、基准板 (IC8.3 IC8.4), 2020年电赛校赛接口板 (Test9.1)
DACS: 2020年电赛校赛测量、基准板 (IC10.5), 2020年电赛校赛接口板 (Test7.1), 2020年电赛校赛数字板 (IC11.32)
DVCS: 2020年电赛校赛测量、基准板 (IC8.5), 2020年电赛校赛接口板 (Test8.1), 2020年电赛校赛数字板 (IC11.31)
EC0: 2020年电赛校赛接口板 (P8.2), 2020年电赛校赛数字板 (IC11.21)
EC1: 2020年电赛校赛接口板 (P8.1), 2020年电赛校赛数字板 (IC11.22)
Fan: 2020年电赛校赛电源板 (R2.2), 2020年电赛校赛接口板 (Test14.1), 2020年电赛校赛数字板 (IC11.29)
High Voltage: 2020年电赛校赛电源板 (K1.1), 2020年电赛校赛接口板 (P1.2)
I set: 2020年电赛校赛接口板 (P9.4), 2020年电赛校赛数字板 (IC11.18)
IP set: 2020年电赛校赛接口板 (P9.2), 2020年电赛校赛数字板 (IC11.39)
K0: 2020年电赛校赛接口板 (P8.3), 2020年电赛校赛数字板 (IC11.46)
Limit: 2020年电赛校赛功率板 (R29.1), 2020年电赛校赛接口板 (Test12.1), 2020年电赛校赛数字板 (IC11.43)
Low Voltage: 2020年电赛校赛电源板 (K1.6), 2020年电赛校赛接口板 (P1.1)
motor: 2020年电赛校赛电源板 (D1.1 Q1.3), 2020年电赛校赛接口板 (P4.1)
OFF: 2020年电赛校赛功率板 (R9.2), 2020年电赛校赛接口板 (Test11.1), 2020年电赛校赛数字板 (IC11.45)
RES: 2020年电赛校赛接口板 (P7.4), 2020年电赛校赛数字板 (IC11.13)
SCL/DSCK: 2020年电赛校赛测量、基准板 (IC8.6 IC10.6), 2020年电赛校赛接口板 (P7.2 Test6.1), 2020年电赛校赛数字板 (IC11.15)
SDA/DMISO: 2020年电赛校赛测量、基准板 (IC8.7 IC10.7), 2020年电赛校赛接口板 (P7.1 Test5.1), 2020年电赛校赛数字板 (IC11.17)
SW: 2020年电赛校赛电源板 (R1.2), 2020年电赛校赛接口板 (Test13.1), 2020年电赛校赛数字板 (IC11.42)
temperature: 2020年电赛校赛电源板 (RS1.3), 2020年电赛校赛接口板 (Test17.1), 2020年电赛校赛数字板 (IC11.12)
Uout+: 2020年电赛校赛功率板 (K2.4), 2020年电赛校赛接口板 (P5.1)
Uout-: 2020年电赛校赛功率板 (7 pins), 2020年电赛校赛接口板 (P5.2)
V set: 2020年电赛校赛接口板 (P9.3), 2020年电赛校赛数字板 (IC11.19)
V+: 2020年电赛校赛功率板 (8 pins), 2020年电赛校赛电源板 (8 pins)
VIN: 2020年电赛校赛功率板 (C34.1 R14.1 R18.2 R19.1), 2020年电赛校赛测量、基准板 (IC9.4 R33.2), 2020年电赛校赛接口板 (Test15.1), 2020年电赛校赛数字板 (IC11.11)
VP set: 2020年电赛校赛接口板 (P9.1), 2020年电赛校赛数字板 (IC11.40)